# Altium schematic sheet SignalProcess.SchDoc
size A
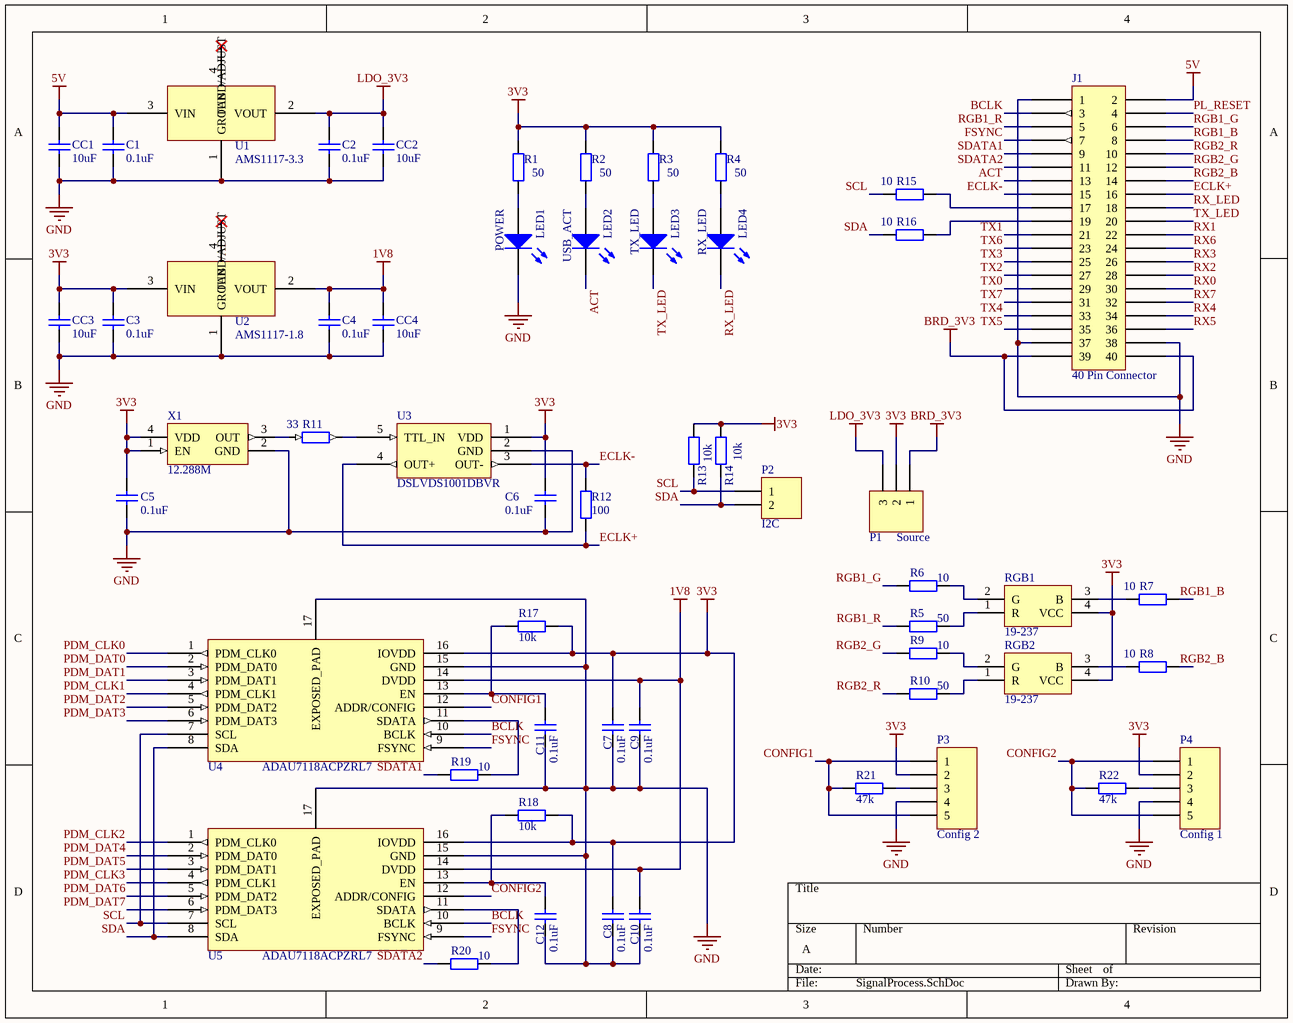
[diagram p0: SignalProcess.SchDoc]

## Parts
C1  0.1uF  [CHIP-0603]
C2  0.1uF  [CHIP-0603]
C3  0.1uF  [CHIP-0603]
C4  0.1uF  [CHIP-0603]
C5  0.1uF  [CHIP-0603]
C6  0.1uF  [CHIP-0603]
C7  0.1uF  [CHIP-0603]
C8  0.1uF  [CHIP-0603]
C9  0.1uF  [CHIP-0603]
C10  0.1uF  [CHIP-0603]
C11  0.1uF  [CHIP-0603]
C12  0.1uF  [CHIP-0603]
CC1  10uF  [CHIP-0603]
CC2  10uF  [CHIP-0603]
CC3  10uF  [CHIP-0603]
CC4  10uF  [CHIP-0603]
J1  40 Pin Connector  [2x20FemaleHeader]
LED1  POWER  [CHIP-0805-LED]
LED2  USB_ACT  [CHIP-0805-LED]
LED3  TX_LED  [CHIP-0805-LED]
LED4  RX_LED  [CHIP-0805-LED]
P1  Source  [HDR1X3]
P2  I2C  [HDR1X2]
P3  Config 2  [HDR1X5]
P4  Config 1  [HDR1X5]
R1  50  [CHIP-0603]
R2  50  [CHIP-0603]
R3  50  [CHIP-0603]
R4  50  [CHIP-0603]
R5  50  [CHIP-0603]
R6  10  [CHIP-0603]
R7  10  [CHIP-0603]
R8  10  [CHIP-0603]
R9  10  [CHIP-0603]
R10  50  [CHIP-0603]
R11  33  [CHIP-0603]
R12  100  [CHIP-0603]
R13  10k  [CHIP-0603]
R14  10k  [CHIP-0603]
R15  10  [CHIP-0603]
R16  10  [CHIP-0603]
R17  10k  [CHIP-0603]
R18  10k  [CHIP-0603]
R19  10  [CHIP-0603]
R20  10  [CHIP-0603]
R21  47k  [CHIP-0603]
R22  47k  [CHIP-0603]
RGB1  19-237  [19-237-R6GHBHC]
RGB2  19-237  [19-237-R6GHBHC]
U1  AMS1117-3.3  [SOT223_AMS1117-1.8_AMS]
U2  AMS1117-1.8  [SOT223_AMS1117-1.8_AMS]
U3  DSLVDS1001DBVR  [SOT-23-5_2P9X1P6_TEX]
U4  ADAU7118ACPZRL7  [QFN50P300X300X80-17N]
U5  ADAU7118ACPZRL7  [QFN50P300X300X80-17N]
X1  12.288M  [S3D12.288000B20F30T]

## Nets
1V8: C4.2 C9.2 C10.2 CC4.2 U2.2(VOUT) U4.14(DVDD) U5.14(DVDD)
3V3: C3.2 C5.2 C6.2 C7.2 C8.2 CC3.2 P1.2 P3.2 P4.2 R1.2 R2.2 R3.2 R4.2 R13.2 R14.2 R17.2 R18.2 RGB1.4(VCC) RGB2.4(VCC) U2.3(VIN) U3.1(VDD) U4.16(IOVDD) U5.16(IOVDD) X1.1(EN) X1.4(VDD)
5V: C1.2 CC1.2 J1.2 U1.3(VIN)
BRD_3V3: J1.39 J1.40 P1.1
GND: C1.1 C2.1 C3.1 C4.1 C5.1 C6.1 C7.1 C8.1 C9.1 C10.1 C11.1 C12.1 CC1.1 CC2.1 CC3.1 CC4.1 J1.1 J1.37 J1.38 LED1.2(K) P3.4 P4.4 U1.1(GROUND/ADJUST) U2.1(GROUND/ADJUST) U3.2(GND) U4.15(GND) U4.17(EXPOSED_PAD) U5.15(GND) U5.17(EXPOSED_PAD) X1.2(GND)
LDO_3V3: C2.2 CC2.2 P1.3 U1.2(VOUT)
ACT: J1.13 LED2.2(K)
BCLK: J1.3 U4.10(BCLK) U5.10(BCLK)
CONFIG1: P3.1 P3.5 R21.1 U4.12(ADDR/CONFIG)
CONFIG2: P4.1 P4.5 R22.1 U5.12(ADDR/CONFIG)
ECLK+: J1.16 R12.2 U3.4(OUT+)
ECLK-: J1.15 R12.1 U3.3(OUT-)
FSYNC: J1.7 U4.9(FSYNC) U5.9(FSYNC)
PDM_CLK0: U4.1(PDM_CLK0)
PDM_CLK1: U4.4(PDM_CLK1)
PDM_CLK2: U5.1(PDM_CLK0)
PDM_CLK3: U5.4(PDM_CLK1)
PDM_DAT0: U4.2(PDM_DAT0)
PDM_DAT1: U4.3(PDM_DAT1)
PDM_DAT2: U4.5(PDM_DAT2)
PDM_DAT3: U4.6(PDM_DAT3)
PDM_DAT4: U5.2(PDM_DAT0)
PDM_DAT5: U5.3(PDM_DAT1)
PDM_DAT6: U5.5(PDM_DAT2)
PDM_DAT7: U5.6(PDM_DAT3)
PL_RESET: J1.4
RGB1_B: J1.8 R7.2
RGB1_G: J1.6 R6.2
RGB1_R: J1.5 R5.1
RGB2_B: J1.14 R8.2
RGB2_G: J1.12 R9.2
RGB2_R: J1.10 R10.1
RX0: J1.30
RX1: J1.22
RX2: J1.28
RX3: J1.26
RX4: J1.34
RX5: J1.36
RX6: J1.24
RX7: J1.32
RX_LED: J1.18 LED4.2(K)
SCL: P2.1 R13.1 R15.1 U4.7(SCL) U5.7(SCL)
SDA: P2.2 R14.1 R16.1 U4.8(SDA) U5.8(SDA)
SDATA1: J1.9 R19.1
SDATA2: J1.11 R20.1
TX0: J1.29
TX1: J1.21
TX2: J1.27
TX3: J1.25
TX4: J1.33
TX5: J1.35
TX6: J1.23
TX7: J1.31
TX_LED: J1.20 LED3.2(K)
NetC11_2: C11.2 R17.1 U4.13(EN)
NetC12_2: C12.2 R18.1 U5.13(EN)
NetJ1_17: J1.17 R15.2
NetJ1_19: J1.19 R16.2
NetLED1_1: LED1.1(A) R1.1
NetLED2_1: LED2.1(A) R2.1
NetLED3_1: LED3.1(A) R3.1
NetLED4_1: LED4.1(A) R4.1
NetP3_3: P3.3 R21.2
NetP4_3: P4.3 R22.2
NetR5_2: R5.2 RGB1.1(R)
NetR6_1: R6.1 RGB1.2(G)
NetR7_1: R7.1 RGB1.3(B)
NetR8_1: R8.1 RGB2.3(B)
NetR9_1: R9.1 RGB2.2(G)
NetR10_2: R10.2 RGB2.1(R)
NetR11_1: R11.1 X1.3(OUT)
NetR11_2: R11.2 U3.5(TTL_IN)
NetR19_2: R19.2 U4.11(SDATA)
NetR20_2: R20.2 U5.11(SDATA)

Not connected (* = marked no-connect by the designer): U1 4(TAB)*; U2 4(TAB)*

## Library data of the parts
C1-C12 CC1-CC4 = Cap: Capacitor; Published: 8-Jun-2000; LatestRevisionDate: 17-Jul-2002; LatestRevisionNote: Re-released for DXP Platform.; PackageReference: RAD-0.3; Publisher: Altium Limited; PackageDescription: Radial Cap, Thru-Hole; 2 Leads; 0.3 in Pin Spacing
J1 = 2x20FemaleHeader
LED1-LED4 = LED0: Typical INFRARED GaAs LED; Published: 8-Jun-2000; LatestRevisionDate: 08-Jul-2005; LatestRevisionNote: Mech Layer 1 removed.; PackageReference: LED-0; Publisher: Altium Limited; PackageDescription: LED; 2 Leads
P1 = Header 3: Header, 3-Pin; LatestRevisionDate: 17-Jul-2002; LatestRevisionNote: Re-released for DXP Platform.; Publisher: Altium Limited
P2 = Header 2: Header, 2-Pin; LatestRevisionDate: 17-Jul-2002; LatestRevisionNote: Re-released for DXP Platform.; Publisher: Altium Limited
P3 P4 = Header 5: Header, 5-Pin; LatestRevisionDate: 17-Jul-2002; LatestRevisionNote: Re-released for DXP Platform.; Publisher: Altium Limited
R1-R22 = Res2: Resistor; Published: 8-Jun-2000; LatestRevisionDate: 17-Jul-2002; LatestRevisionNote: Re-released for DXP Platform.; PackageReference: AXIAL-0.4; Publisher: Altium Limited; PackageDescription: Axial Device, Thru-Hole; 2 Leads; 0.4 in Pin Spacing
RGB1 RGB2 = 19-237-R6GHBHC: pin to pad: 1>R 2>G 3>B 4>VCC
U1 U2 = AMS1117-1.8: No Description Available; Mfr_Name: ams OSRAM; Copyright: Copyright (C) 2023 Ultra Librarian. All rights reserved.; Manufacturer_Part_Number: AMS1117-1.8; RefDes: RefDes; Type: DEV
U3 = DSLVDS1001DBVR: No Description Available; Mfr_Name: Texas Instruments; RefDes: RefDes; Type: Type
X1 = S3D12.288000B20F30T